# EasyEDA schematic Reefwing-NFC-Card-RevD.json
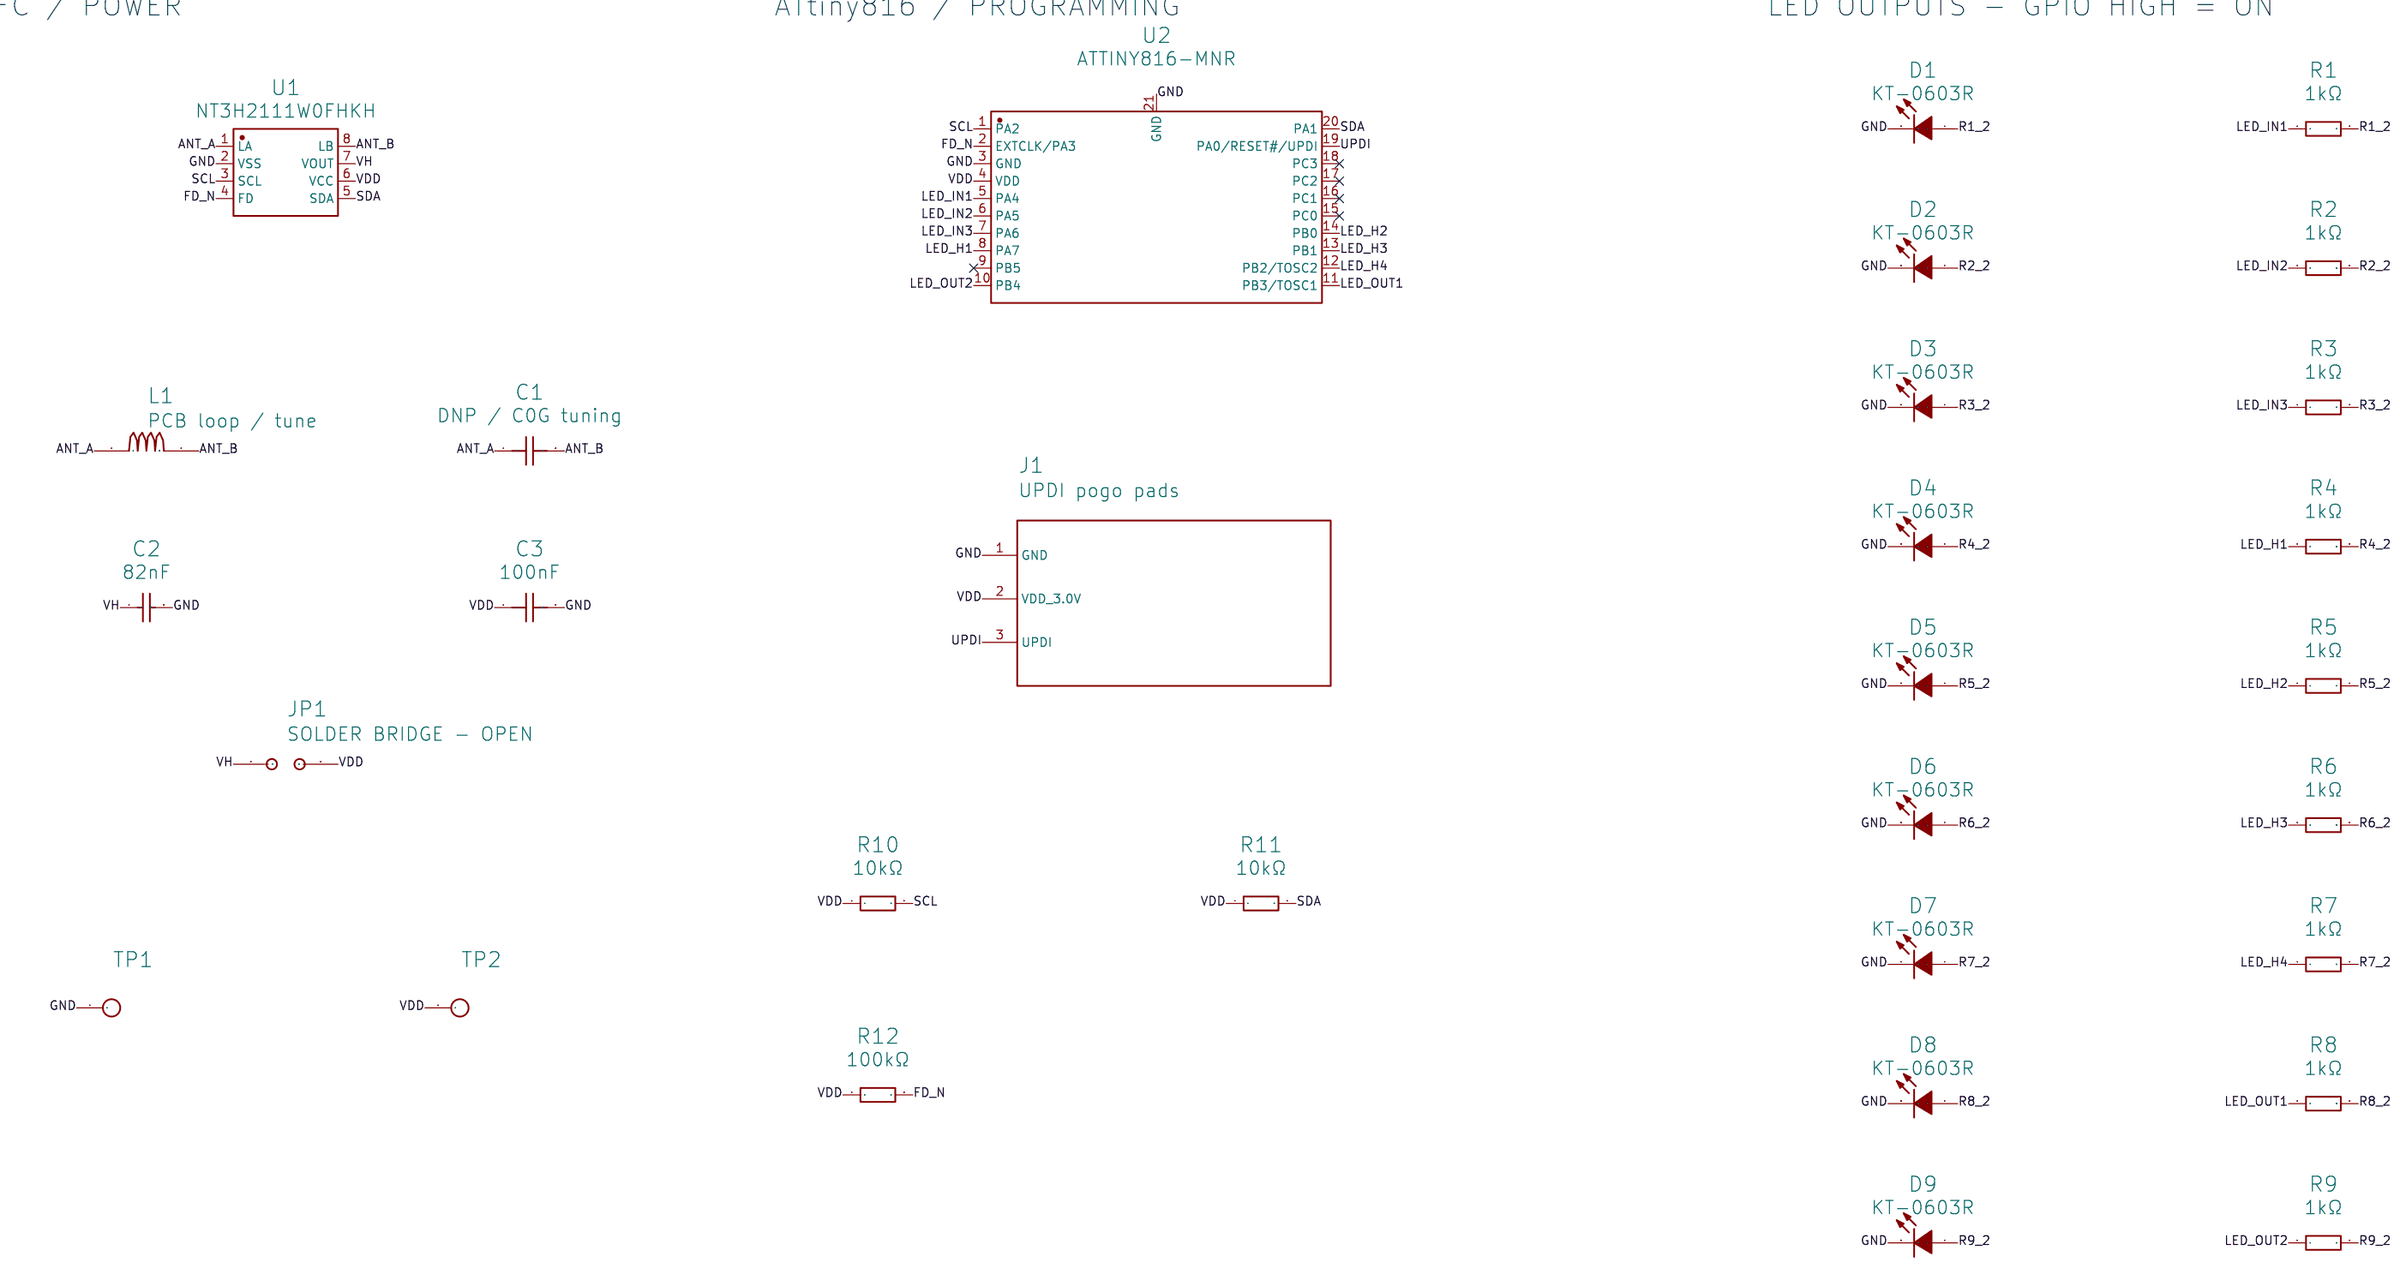
[diagram p0: schematic sheet]

## Parts
C1  DNP / C0G tuning  [C0603]
C2  82nF  [C0603]
C3  100nF  [C0603]
D1  KT-0603R  [LED-SMD_L1.6-W0.8-R-RD]
D2  KT-0603R  [LED-SMD_L1.6-W0.8-R-RD]
D3  KT-0603R  [LED-SMD_L1.6-W0.8-R-RD]
D4  KT-0603R  [LED-SMD_L1.6-W0.8-R-RD]
D5  KT-0603R  [LED-SMD_L1.6-W0.8-R-RD]
D6  KT-0603R  [LED-SMD_L1.6-W0.8-R-RD]
D7  KT-0603R  [LED-SMD_L1.6-W0.8-R-RD]
D8  KT-0603R  [LED-SMD_L1.6-W0.8-R-RD]
D9  KT-0603R  [LED-SMD_L1.6-W0.8-R-RD]
J1  UPDI pogo pads  [REEFWING_UPDI_3PAD_P254_D150]
JP1  SOLDER BRIDGE - OPEN  [REEFWING_SOLDER_BRIDGE_2P_G030]
L1  PCB loop / tune  [REEFWING_NFC_76X44_4T_W040_S040]
R1  1kΩ  [R0603]
R2  1kΩ  [R0603]
R3  1kΩ  [R0603]
R4  1kΩ  [R0603]
R5  1kΩ  [R0603]
R6  1kΩ  [R0603]
R7  1kΩ  [R0603]
R8  1kΩ  [R0603]
R9  1kΩ  [R0603]
R10  10kΩ  [R0603]
R11  10kΩ  [R0603]
R12  100kΩ  [R0603]
TP1  TEST PAD  [REEFWING_TP_D150]
TP2  TEST PAD  [REEFWING_TP_D150]
U1  NT3H2111W0FHKH  [XQFN-8_L1.6-W1.6-P0.50-BL_NT3H2111W0FHKH]
U2  ATTINY816-MNR  [UQFN-20_L3.0-W3.0-P0.40-BL-EP1.7]

## Library data of the parts
C2 = -: Supplier: LCSC; Manufacturer: YAGEO(国巨); Manufacturer Part: CC0603KRX7R9BB823; Supplier Part: C107100; JLCPCB Part Class: Extended Part
C3 = -: Supplier: LCSC; Manufacturer: YAGEO(国巨); Manufacturer Part: CC0603KRX7R9BB104; Supplier Part: C14663; JLCPCB Part Class: Basic Part
D1-D9 = -: Supplier: LCSC; Manufacturer: KENTO; Supplier Part: C2286; JLCPCB Part Class: Basic Part
R1-R9 = -: Supplier: LCSC; Manufacturer: UNI-ROYAL(厚声); Manufacturer Part: 0603WAF1001T5E; Supplier Part: C21190; JLCPCB Part Class: Basic Part
R10 R11 = -: Supplier: LCSC; Manufacturer: UNI-ROYAL(厚声); Manufacturer Part: 0603WAF1002T5E; Supplier Part: C25804; JLCPCB Part Class: Basic Part
R12 = -: Supplier: LCSC; Manufacturer: UNI-ROYAL(厚声); Manufacturer Part: 0603WAF1003T5E; Supplier Part: C25803; JLCPCB Part Class: Basic Part
U1 = -: Contributor: LCSC; Supplier: LCSC; Supplier Part: C710403; Manufacturer: NXP(恩智浦); JLCPCB Part Class: Extended Part
U2 = -: Contributor: LCSC; Supplier: LCSC; Supplier Part: C2052778; Manufacturer: MICROCHIP(美国微芯); JLCPCB Part Class: Extended Part

## Nets
GND: C2.2 C3.2 D1.2(K) D2.2(K) D3.2(K) D4.2(K) D5.2(K) D6.2(K) D7.2(K) D8.2(K) D9.2(K) J1.1(GND) TP1.1 U1.2(VSS) U2.3(GND) U2.21(GND)
VDD: C3.1 J1.2(VDD 3.0V) JP1.2 R10.1 R11.1 R12.1 TP2.1 U1.6(VCC) U2.4(VDD)
ANT_A: C1.1 L1.1 U1.1(LA)
ANT_B: C1.2 L1.2 U1.8(LB)
FD_N: R12.2 U1.4(FD) U2.2(EXTCLK/PA3)
LED_H1: R4.1 U2.8(PA7)
LED_H2: R5.1 U2.14(PB0)
LED_H3: R6.1 U2.13(PB1)
LED_H4: R7.1 U2.12(PB2/TOSC2)
LED_IN1: R1.1 U2.5(PA4)
LED_IN2: R2.1 U2.6(PA5)
LED_IN3: R3.1 U2.7(PA6)
LED_OUT1: R8.1 U2.11(PB3/TOSC1)
LED_OUT2: R9.1 U2.10(PB4)
R1_2: D1.1(A) R1.2
R2_2: D2.1(A) R2.2
R3_2: D3.1(A) R3.2
R4_2: D4.1(A) R4.2
R5_2: D5.1(A) R5.2
R6_2: D6.1(A) R6.2
R7_2: D7.1(A) R7.2
R8_2: D8.1(A) R8.2
R9_2: D9.1(A) R9.2
SCL: R10.2 U1.3(SCL) U2.1(PA2)
SDA: R11.2 U1.5(SDA) U2.20(PA1)
UPDI: J1.3(UPDI) U2.19(PA0/RESET#/UPDI)
VH: C2.1 JP1.1 U1.7(VOUT)

Not connected (* = marked no-connect by the designer): U2 9(PB5)* 15(PC0)* 16(PC1)* 17(PC2)* 18(PC3)*

## Notes on the sheet
- REEFWING / EMBEDDED AI - REV D
- Supplied EasyEDA/LCSC symbols and linked footprints - 1 October 2026
- NFC / POWER
- ATtiny816 / PROGRAMMING
- LED OUTPUTS - GPIO HIGH = ON
- D1-D9: manufacturer pin 1 = A (+), pin 2 = K (-). Supplier symbol orientation retained.
- GPIO -> 1k resistor -> LED anode; cathode -> GND. PCB LED placement remains at 180 degrees.
- J1: GND / VDD / UPDI. Programming: JP1 OPEN, no NFC field, regulated 3.0 V with matching UPDI levels.
- Disconnect programmer before closing JP1 for NFC power. TP1 = GND; TP2 = VDD (3V).
- PA1=SDA, PA2=SCL: set PORTMUX.CTRLB |= PORTMUX_TWI0_bm before TWI initialization.
- FD_N: U1.4 -> U2.2 (PA3), 100k pull-up. Configure FD_ON=00 and FD_OFF=00 for field detection.
- Unused PB5 / PC0-PC3: pull-ups or disable digital inputs. Keep PA0 configured as UPDI.
- 1 MHz internal clock for low current; prototype BOD disabled, verify fuses. No operation claimed below 1.8 V.
- C1 is DNP: tune antenna after measurement; do not short. C2+C3 = 182nF nominal; no bulk reservoir.
- URL provisioning: I2C sketch or RF. Avoid I2C activity during animation. Native ERC/DRC and assembly review pending.
